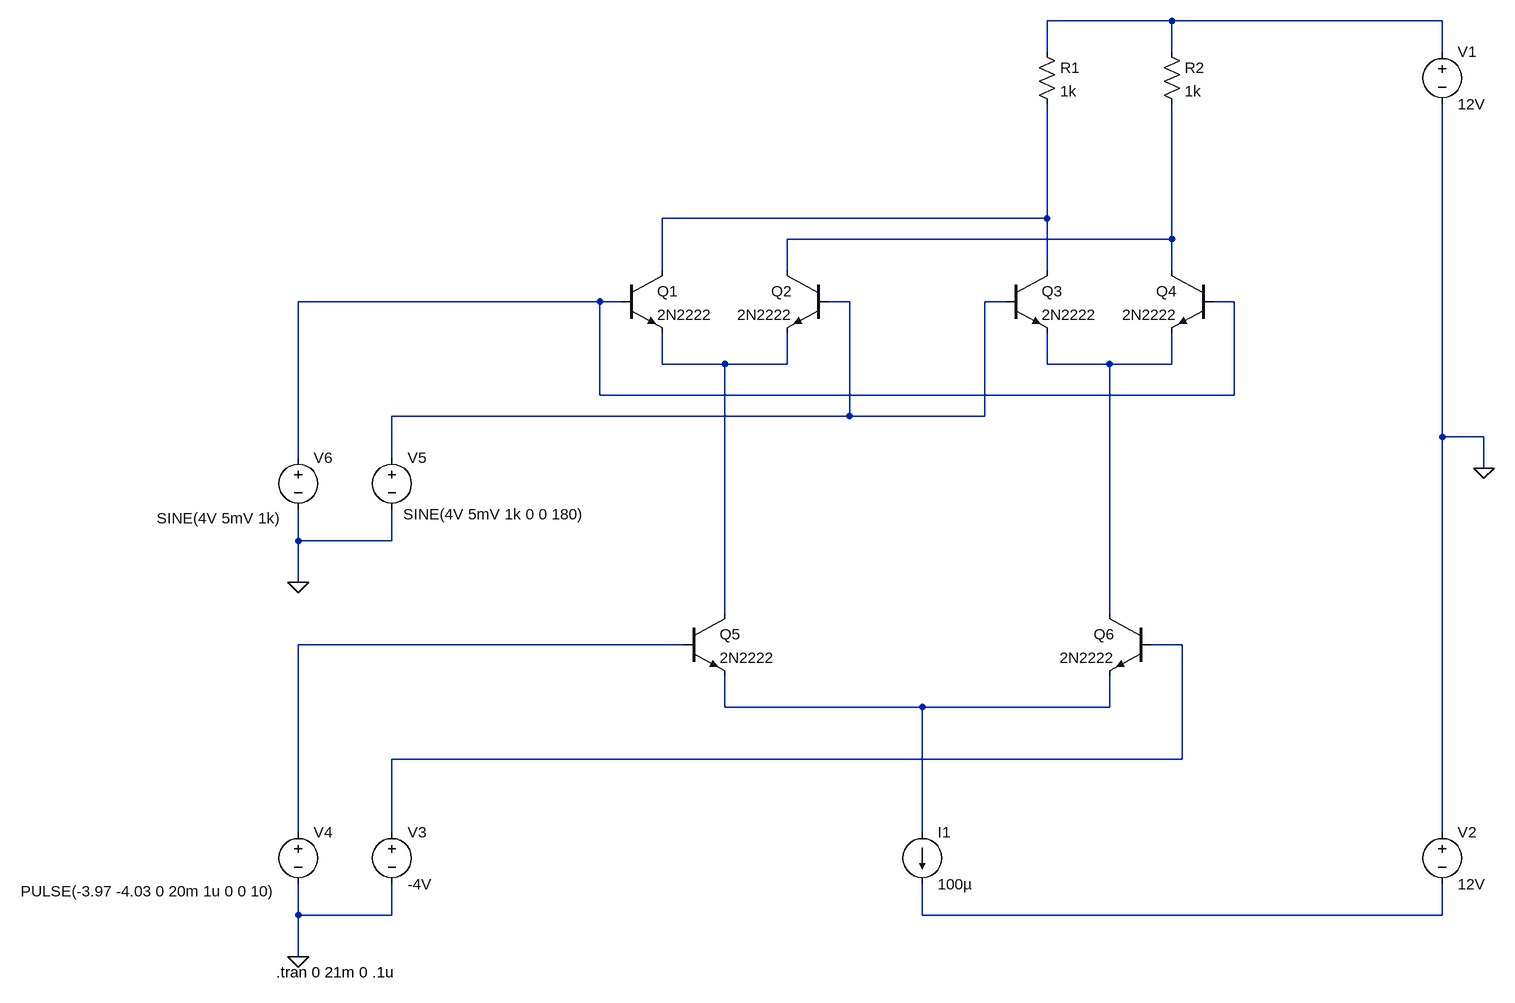
[diagram p0: schematic ring_modulator.asc]
ring_modulator.asc, the LTspice schematic file:
Version 4
SHEET 1 1188 1232
WIRE 688 -304 496 -304
WIRE 1104 -304 688 -304
WIRE 496 -256 496 -304
WIRE 688 -256 688 -304
WIRE 1104 -256 1104 -304
WIRE 496 0 496 -176
WIRE 496 0 -96 0
WIRE 688 32 688 -176
WIRE 688 32 96 32
WIRE -96 80 -96 0
WIRE 96 80 96 32
WIRE 496 80 496 0
WIRE 688 80 688 32
WIRE -192 128 -656 128
WIRE -160 128 -192 128
WIRE 192 128 160 128
WIRE 432 128 400 128
WIRE 784 128 752 128
WIRE -96 224 -96 176
WIRE 0 224 -96 224
WIRE 96 224 96 176
WIRE 96 224 0 224
WIRE 496 224 496 176
WIRE 592 224 496 224
WIRE 688 224 688 176
WIRE 688 224 592 224
WIRE -192 272 -192 128
WIRE 784 272 784 128
WIRE 784 272 -192 272
WIRE 192 304 192 128
WIRE 192 304 -512 304
WIRE 400 304 400 128
WIRE 400 304 192 304
WIRE 1104 336 1104 -176
WIRE 1168 336 1104 336
WIRE -656 368 -656 128
WIRE -512 368 -512 304
WIRE 1168 384 1168 336
WIRE -656 496 -656 448
WIRE -512 496 -512 448
WIRE -512 496 -656 496
WIRE -656 560 -656 496
WIRE 0 608 0 224
WIRE 592 608 592 224
WIRE -64 656 -656 656
WIRE 704 656 656 656
WIRE 0 752 0 704
WIRE 304 752 0 752
WIRE 592 752 592 704
WIRE 592 752 304 752
WIRE 704 832 704 656
WIRE 704 832 -512 832
WIRE -656 944 -656 656
WIRE -512 944 -512 832
WIRE 304 944 304 752
WIRE 1104 944 1104 336
WIRE -656 1072 -656 1024
WIRE -512 1072 -512 1024
WIRE -512 1072 -656 1072
WIRE 304 1072 304 1024
WIRE 1104 1072 1104 1024
WIRE 1104 1072 304 1072
WIRE -656 1136 -656 1072
FLAG 1168 384 0
FLAG -656 1136 0
FLAG -656 560 0
SYMBOL npn2 -160 80 R0
SYMATTR InstName Q1
SYMATTR Value 2N2222
SYMBOL npn2 160 80 M0
SYMATTR InstName Q2
SYMATTR Value 2N2222
SYMBOL npn2 432 80 R0
SYMATTR InstName Q3
SYMATTR Value 2N2222
SYMBOL npn2 752 80 M0
SYMATTR InstName Q4
SYMATTR Value 2N2222
SYMBOL res 480 -272 R0
SYMATTR InstName R1
SYMATTR Value 1k
SYMBOL res 672 -272 R0
SYMATTR InstName R2
SYMATTR Value 1k
SYMBOL npn2 -64 608 R0
SYMATTR InstName Q5
SYMATTR Value 2N2222
SYMBOL npn2 656 608 M0
SYMATTR InstName Q6
SYMATTR Value 2N2222
SYMBOL voltage 1104 -272 R0
WINDOW 123 0 0 Left 0
WINDOW 39 0 0 Left 0
SYMATTR InstName V1
SYMATTR Value 12V
SYMBOL voltage 1104 928 R0
WINDOW 123 0 0 Left 0
WINDOW 39 0 0 Left 0
SYMATTR InstName V2
SYMATTR Value 12V
SYMBOL current 304 944 R0
WINDOW 123 0 0 Left 0
WINDOW 39 0 0 Left 0
SYMATTR InstName I1
SYMATTR Value 100µ
SYMBOL voltage -512 928 R0
WINDOW 123 0 0 Left 0
WINDOW 39 0 0 Left 0
SYMATTR InstName V3
SYMATTR Value -4V
SYMBOL voltage -656 928 R0
WINDOW 3 -427 107 Left 2
WINDOW 123 0 0 Left 0
WINDOW 39 0 0 Left 0
SYMATTR InstName V4
SYMATTR Value PULSE(-3.97 -4.03 0 20m 1u 0 0 10)
SYMBOL voltage -512 352 R0
WINDOW 3 17 103 Left 2
WINDOW 123 0 0 Left 0
WINDOW 39 0 0 Left 0
SYMATTR InstName V5
SYMATTR Value SINE(4V 5mV 1k 0 0 180)
SYMBOL voltage -656 352 R0
WINDOW 3 -218 109 Left 2
WINDOW 123 0 0 Left 0
WINDOW 39 0 0 Left 0
SYMATTR InstName V6
SYMATTR Value SINE(4V 5mV 1k)
TEXT -690 1160 Left 2 !.tran 0 21m 0 .1u

The netlist it stands for:
* ring_modulator.asc
Q1 N002 N004 N006 0 2N2222
Q2 N003 N005 N006 0 2N2222
Q3 N002 N005 N007 0 2N2222
Q4 N003 N004 N007 0 2N2222
R1 N001 N002 1k
R2 N001 N003 1k
Q5 N006 N008 N010 0 2N2222
Q6 N007 N009 N010 0 2N2222
V1 N001 0 12V
V2 0 N011 12V
I1 N010 N011 100µ
V3 N009 0 -4V
V4 N008 0 PULSE(-3.97 -4.03 0 20m 1u 0 0 10)
V5 N005 0 SINE(4V 5mV 1k 0 0 180)
V6 N004 0 SINE(4V 5mV 1k)
.model NPN NPN
.model PNP PNP
.lib standard.bjt
.tran 0 21m 0 .1u
.backanno
.end